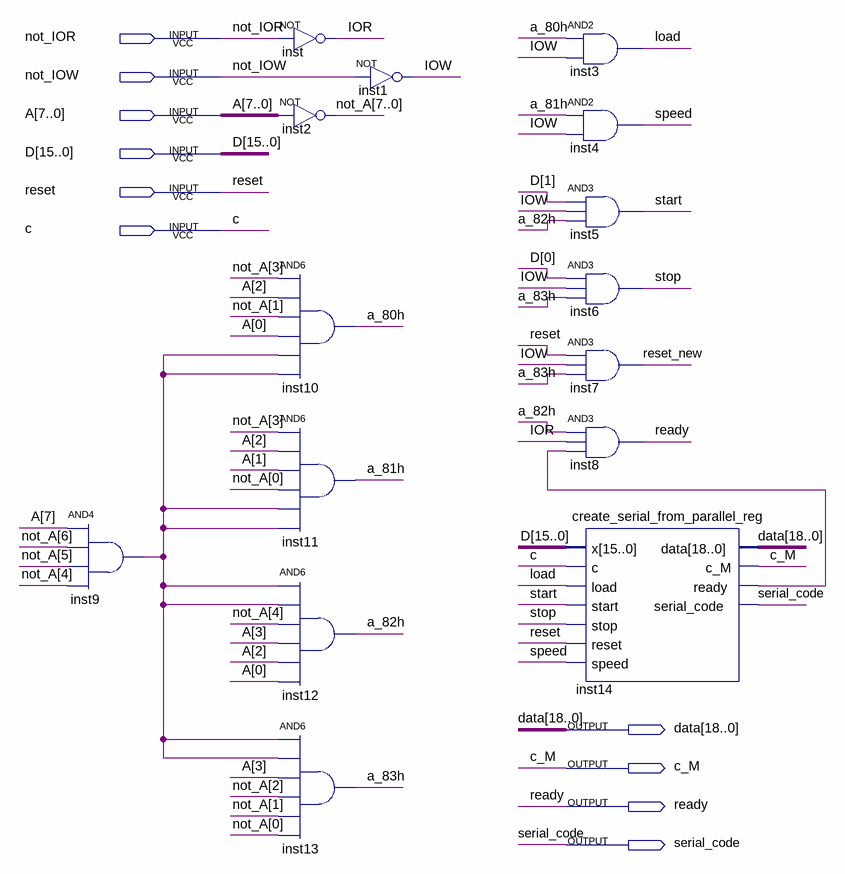
[diagram p0: schematic sheet]
// Quartus schematic processor_interface_reg.bdf as structural Verilog: 15 symbols, 10 pins
module processor_interface_reg (
  input  not_IOR,
  input  not_IOW,
  input  [7:0] A,
  input  [15:0] D,
  input  reset,
  input  c,
  output [18:0] data,
  output c_M,
  output ready,
  output serial_code
);

  wire a_80h, a_81h, a_82h, a_83h, inst9_out, inst14_ready, IOR, IOW, load, reset_new, speed, start, stop;
  wire [7:0] not_A;

  and inst9 (inst9_out, A[7], not_A[6], not_A[5], not_A[4]);
  not inst (IOR, not_IOR);
  assign not_A = ~A;  // NOT inst2, 8 bits wide
  and inst10 (a_80h, not_A[3], A[2], not_A[1], A[0], inst9_out, inst9_out);
  and inst11 (a_81h, not_A[3], A[2], A[1], not_A[0], inst9_out, inst9_out);
  and inst12 (a_82h, inst9_out, inst9_out, not_A[4], A[3], A[2], A[0]);
  and inst13 (a_83h, inst9_out, inst9_out, A[3], not_A[2], not_A[1], not_A[0]);
  not inst1 (IOW, not_IOW);
  and inst3 (load, a_80h, IOW);
  and inst4 (speed, a_81h, IOW);
  and inst5 (start, D[1], IOW, a_82h);
  and inst6 (stop, D[0], IOW, a_83h);
  and inst7 (reset_new, reset, IOW, a_83h);
  and inst8 (ready, a_82h, IOR, inst14_ready);
  create_serial_from_parallel_reg inst14 (
    .x(D), .c(c), .load(load), .start(start), .stop(stop), .reset(reset), .speed(speed), .data(data),
    .c_M(c_M), .ready(inst14_ready), .serial_code(serial_code));
endmodule
